# EAGLE design board (EAGLE 8.0.2)
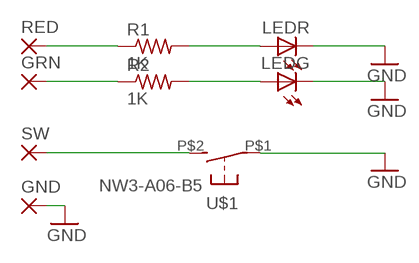
[diagram p0: schematic, sheet 1]

## Parts
GND  SMD5  [SMD2,54-5,08]
GRN  SMD5  [SMD2,54-5,08]
LEDG  LEDCHIP-LED0805  [CHIP-LED0805]
LEDR  LEDCHIP-LED0805  [CHIP-LED0805]
R1  1K  R-US_M2012  [M2012]
R2  1K  R-US_M2012  [M2012]
RED  SMD5  [SMD2,54-5,08]
SW  SMD5  [SMD2,54-5,08]
U$1  NW3-A06-B5  [DTSM-3-R]

## Nets
GND: GND.1(P) LEDG.C LEDR.C U$1.P$1
N$1: R1.1 RED.1(P)
N$2: GRN.1(P) R2.1
N$3: LEDR.A R1.2
N$4: LEDG.A R2.2
N$5: SW.1(P) U$1.P$2

## Library data of the parts
GND GRN RED SW = wirepad:SMD5: SMD PAD
LEDG LEDR = led:LED: LED OSRAM: - CHIPLED LG R971, LG N971, LY N971, LG Q971, LY Q971, LO R971, LY R971 LH N974, LH R974 LS Q976, LO Q976, LY Q976 LO Q996 - Hyper CHIPLED LW Q18S LB Q993, LB Q99A, LB R99A - SideLED LS A670, LO A670, LY A670, LG A670, LP A670 LB A673, LV A673, LT A673, LW A673 LH A674 LY A675 LS A676, LA A676, LO A676, LY A676, LW A676 LS A679, LY A679, LG A679 - Hyper Micro SIDELED® LS Y876, LA Y876, LO Y876, LY Y876 LT Y87S - SmartLED LW L88C, LW L88S LB L89C, LB L89S, LG L890 LS L89K, LO L89K, LY L89K LS L896, LA L896, LO L896, LY L896 - TOPLED LS T670, LO T670, LY T670, LG T670, LP T670 LSG T670, LSP T670, LSY T670, LOP T670, LYG T670 LG T671, LOG T671, LSG T671 LB T673, LV T673, LT T673, LW T673 LH T674 LS T676, LA T676, LO T676, LY T676, LB T676, LH T676, LSB T676, LW T676 LB T67C, LV T67C, LT T67C, LS T67K, LO T67K, LY T67K, LW E67C LS E67B, LA E67B, LO E67B, LY E67B, LB E67C, LV E67C, LT E67C LW T67C LS T679, LY T679, LG T679 LS T770, LO T770, LY T770, LG T770, LP T770 LB T773, LV T773, LT T773, LW T773 LH T774 LS E675, LA E675, LY E675, LS T675 LS T776, LA T776, LO T776, LY T776, LB T776 LHGB T686 LT T68C, LB T68C - Hyper Mini TOPLED® LB M676 - Mini TOPLED Santana® LG M470 LS M47K, LO M47K, LY M47K Source: http://www.osram.convergy.de LUXEON: - LUMILED® LXK2-PW12-R00, LXK2-PW12-S00, LXK2-PW14-U00, LXK2-PW14-V00 LXK2-PM12-R00, LXK2-PM12-S00, LXK2-PM14-U00 LXK2-PE12-Q00, LXK2-PE12-R00, LXK2-PE12-S00, LXK2-PE14-T00, LXK2-PE14-U00 LXK2-PB12-K00, LXK2-PB12-L00, LXK2-PB12-M00, LXK2-PB14-N00, LXK2-PB14-P00, LXK2-PB14-Q00 LXK2-PR12-L00, LXK2-PR12-M00, LXK2-PR14-Q00, LXK2-PR14-R00 LXK2-PD12-Q00, LXK2-PD12-R00, LXK2-PD12-S00 LXK2-PH12-R00, LXK2-PH12-S00 LXK2-PL12-P00, LXK2-PL12-Q00, LXK2-PL12-R00 Source: www.luxeon.com KINGBRIGHT: KA-3528ASYC Source: www.kingbright.com
R1 R2 = resistor:R-US_: RESISTOR, American symbol
U$1 = switch-tact:NW3-A06-B5: Micro Tactile Switch http://www.devicemart.co.kr/1322070

## Board
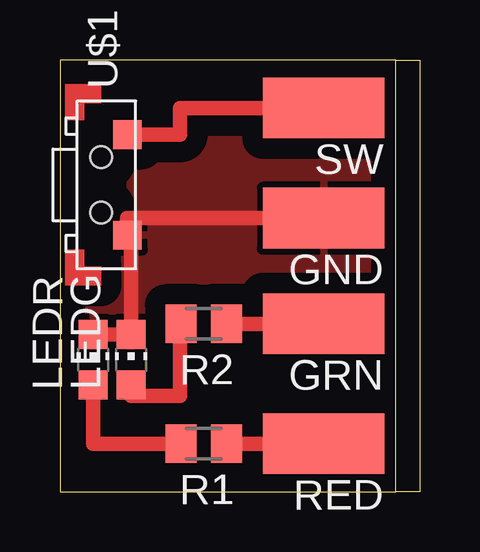
[diagram p1: board, top side]

Size 15 x 18 mm. Coordinates in mm from the lower left corner, seen from the top.
Outline: 14,0 0,0 0,18 14,18
Outline: 14,0 14,18
Outline: 14,18 15,18 15,0 14,0
Copper layers (1*16): Top 0.035mm / dielectric 1.5mm / Bottom 0.035mm
Design rules "default": minimum track width 10mil, minimum drill 24mil, track to track 8mil, track to pad 8mil, pad to pad 8mil, via to via 8mil, smd to smd 8mil, copper to edge 40mil, drill to drill 8mil, minimum pad ring 10mil, minimum via ring 8mil, stop-mask expansion 4mil, vias tented up to drill 0mil, thermal gap 10mil

### Footprints (pad centres in the part's own frame; a part is rotated, then mirrored left to right if it is on the bottom)
SMD2,54-5,08 = smd 2.54 x 5.08: 1 0,0
CHIP-LED0805 = smd 1.2 x 1.2: A 0,-1.05; C 0,1.05
M2012 = smd 1.3 x 1.6: 1 -0.95,0; 2 0.95,0
DTSM-3-R = smd 1.2 x 1.2: P$1 -2.1,0.6; P$2 2.1,0.6 | hole 0.9: 1.15,1.7; -1.15,1.7

### Placement (x,y rotation side)
GND  11,11.4 90 top
GRN  11,7 90 top
LEDG  2.97,5.5 0 top
LEDR  1.38,5.5 0 top
R1  6,2 180 top
R2  6,7 180 top
RED  11,2 90 top
SW  11,16 90 top
U$1  3.41,12.79 90 top

### Tracks (layer width: path | path; a pad name or v marks a point on that pad's centre or on a via)
GND
  Top 0.61: GND.1 2.81,11.4 U$1.P$1 2.97,10.69 LEDG.C LEDR.C
  pour Top (isolate 0.85): 0,18 14,18 14,0 0,0
N$1
  Top 0.61: R1.1 RED.1
N$2
  Top 0.61: GRN.1 R2.1
N$3
  Top 0.61: R1.2 1.38,2 LEDR.A
N$4
  Top 0.61: R2.2 5,7 5,4 2.97,4 LEDG.A
N$5
  Top 0.61: U$1.P$2 5,14.89 5,16 SW.1